# EAGLE design Luminis (EAGLE 9.0.0)
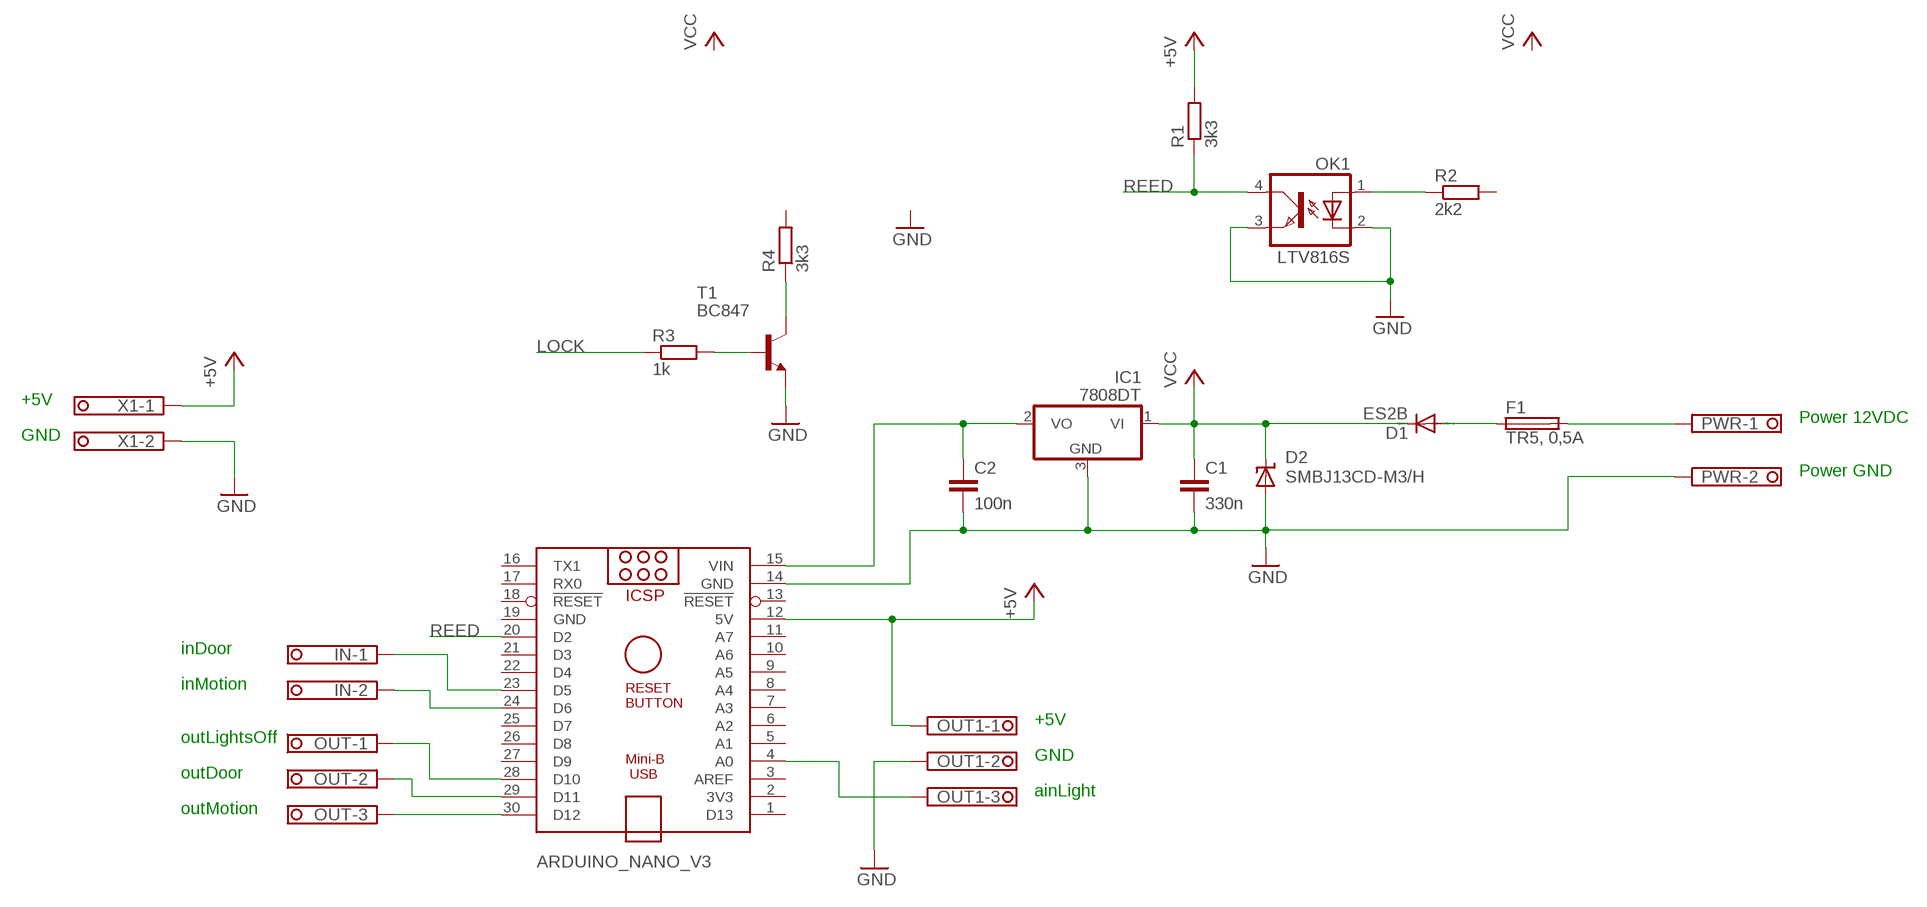
[diagram p0: schematic, sheet 1]

## Parts
ARDUINO_NANO_V3  ARDUINO_NANO  [ARDUINO_NANO]
C1  330n  C-EUC1206  [C1206]
C2  100n  C-EUC1206  [C1206]
D1  ES2B  DIODE-SMB  [SMB]
D2  SMBJ13CD-M3/H  SUPPRESSOR-SMBJ  [SMBJ]
F1  TR5, 0,5A  TR5  [TR5]
IC1  7808DT  [TO252]
IN  1751248  [1751248]
OK1  LTV816S  [DIL4-SMD]
OUT  1751251  [1751251]
OUT1  1751251  [1751251]
PWR  1751248  [1751248]
R1  3k3  R-EU_R1206  [R1206]
R2  2k2  R-EU_R1206  [R1206]
R3  1k  R-EU_R1206  [R1206]
R4  3k3  R-EU_R1206  [R1206]
T1  BC847  [SOT23]
X1  1751248  [1751248]

## Nets
+5V: ARDUINO_NANO_V3.12(5V) OUT1.1 R1.2 X1.1
GND: ARDUINO_NANO_V3.14(GND) C1.2 C2.2 D2.A IC1.3(GND) OK1.2(C) OK1.3(EMIT) OUT1.2 PWR.2 T1.2(E) X1.2
LOCK: R3.1
N$1: ARDUINO_NANO_V3.4(A0) OUT1.3
N$2: OK1.1(A) R2.1
N$3: ARDUINO_NANO_V3.30(D12) OUT.3
N$4: R4.1 T1.3(C)
N$5: F1.2 PWR.1
N$6: ARDUINO_NANO_V3.29(D11) OUT.2
N$7: ARDUINO_NANO_V3.28(D10) OUT.1
N$9: ARDUINO_NANO_V3.24(D6) IN.2
N$10: ARDUINO_NANO_V3.23(D5) IN.1
N$14: R3.2 T1.1(B)
N$46: D1.A F1.1
N$48: ARDUINO_NANO_V3.15(VIN) C2.1 IC1.2(VO)
REED: ARDUINO_NANO_V3.20(D2) OK1.4(COL) R1.1
VCC: C1.1 D1.C D2.C IC1.1(VI)
Unconnected: ARDUINO_NANO_V3.1(D13) ARDUINO_NANO_V3.2(3V3) ARDUINO_NANO_V3.3(AREF) ARDUINO_NANO_V3.5(A1) ARDUINO_NANO_V3.6(A2) ARDUINO_NANO_V3.7(A3) ARDUINO_NANO_V3.8(A4) ARDUINO_NANO_V3.9(A5) ARDUINO_NANO_V3.10(A6) ARDUINO_NANO_V3.11(A7) ARDUINO_NANO_V3.13(!RESET) ARDUINO_NANO_V3.16(TX1) ARDUINO_NANO_V3.17(RX0) ARDUINO_NANO_V3.18(!RESET) ARDUINO_NANO_V3.21(D3) ARDUINO_NANO_V3.22(D4) ARDUINO_NANO_V3.25(D7) ARDUINO_NANO_V3.26(D8) ARDUINO_NANO_V3.27(D9) R2.2 R4.2

## Notes on the sheet
- +5V
- Power 12VDC
- GND
- Power GND
- inDoor
- inMotion
- +5V
- outLightsOff
- GND
- outDoor
- ainLight
- outMotion

## Power pins joined to a net without a drawn wire
GND: ARDUINO_NANO_V3.19(GND)

## Library data of the parts
ARDUINO_NANO_V3 = ArduinoNanoV30:ARDUINO_NANO: Arduino Nano V3.0 Overview: The Arduino Nano is a small, complete, and breadboard-friendly board based on the ATmega328 (Arduino Nano 3.x) or ATmega168 (Arduino Nano 2.x). It has more or less the same functionality of the Arduino Duemilanove, but in a different package. It lacks only a DC power jack, and works with a Mini-B USB cable instead of a standard one. The Nano was designed and is being produced by Gravitech. Specifications: Microcontroller Atmel ATmega168 or ATmega328 Operating Voltage (logic level) 5 V Input Voltage (recommended) 7-12 V Input Voltage (limits) 6-20 V Digital I/O Pins 14 (of which 6 provide PWM output) Analog Input Pins 8 DC Current per I/O Pin 40 mA Flash Memory 16 KB (ATmega168) or 32 KB (ATmega328) of which 2 KB used by bootloader SRAM 1 KB (ATmega168) or 2 KB (ATmega328) EEPROM 512 bytes (ATmega168) or 1 KB (ATmega328) Clock Speed 16 MHz Dimensions 0.73" x 1.70" Length 45 mm Width 18 mm Weigth 5 g Power: The Arduino Nano can be powered via the Mini-B USB connection, 6-20V unregulated external power supply (pin 30), or 5V regulated external power supply (pin 27). The power source is automatically selected to the highest voltage source. Memory: The ATmega168 has 16 KB of flash memory for storing code (of which 2 KB is used for the bootloader); the ATmega328 has 32 KB, (also with 2 KB used for the bootloader). The ATmega168 has 1 KB of SRAM and 512 bytes of EEPROM (which can be read and written with the EEPROM library); the ATmega328 has 2 KB of SRAM and 1 KB of EEPROM. Input and Output: Each of the 14 digital pins on the Nano can be used as an input or output, using pinMode(), digitalWrite(), and digitalRead() functions. They operate at 5 volts. Each pin can provide or receive a maximum of 40 mA and has an internal pull-up resistor (disconnected by default) of 20-50 kOhms. In addition, some pins have specialized functions. Visit Arduino - ArduinoBoardNano <https://www.arduino.cc/en/Main/ArduinoBoardNano>
C1 C2 = rcl:C-EU: CAPACITOR, European symbol; SPICEPREFIX: C
D1 = diode:DIODE-: DIODE
D2 = diode:SUPPRESSOR-: Suppressor diode
F1 = fuse:TR5: FUSE Wickmann; OC_FARNELL: unknown; OC_NEWARK: unknown
IC1 = linear:78*: Positive VOLTAGE REGULATOR Source: http://cache.national.com/ds/LM/LM78L05.pdf http://www.fairchildsemi.com/ds/LM/LM7805.pdf
IN PWR X1 = con-phoenix-350:1751248: MKDS 1/ 2-3,5 Printklemme Nennstrom: 10 A Bemessungsspannung: 160 V Raster: 3,5 mm Polzahl: 2 Montageart: Löten Anschlussart: Schraubanschluss Anschlussrichtung vom Leiter zur Platine: 0° Source: http://eshop.phoenixcontact.com .. 1751248.pdf; OC_FARNELL: unknown; OC_NEWARK: unknown
OK1 = optocoupler:LTV816: OPTO COUPLER Source: LITEON, LTV816.pdf
OUT OUT1 = con-phoenix-350:1751251: MKDS 1/ 3-3,5 Printklemme Nennstrom: 10 A Bemessungsspannung: 160 V Raster: 3,5 mm Polzahl: 3 Montageart: Löten Anschlussart: Schraubanschluss Anschlussrichtung vom Leiter zur Platine: 0° Source: http://eshop.phoenixcontact.com .. 1751251.pdf; OC_FARNELL: unknown; OC_NEWARK: unknown
R1-R4 = rcl:R-EU_: RESISTOR, European symbol; SPICEPREFIX: R
T1 = transistor:BC847: NPN TRANSISTOR

## Board
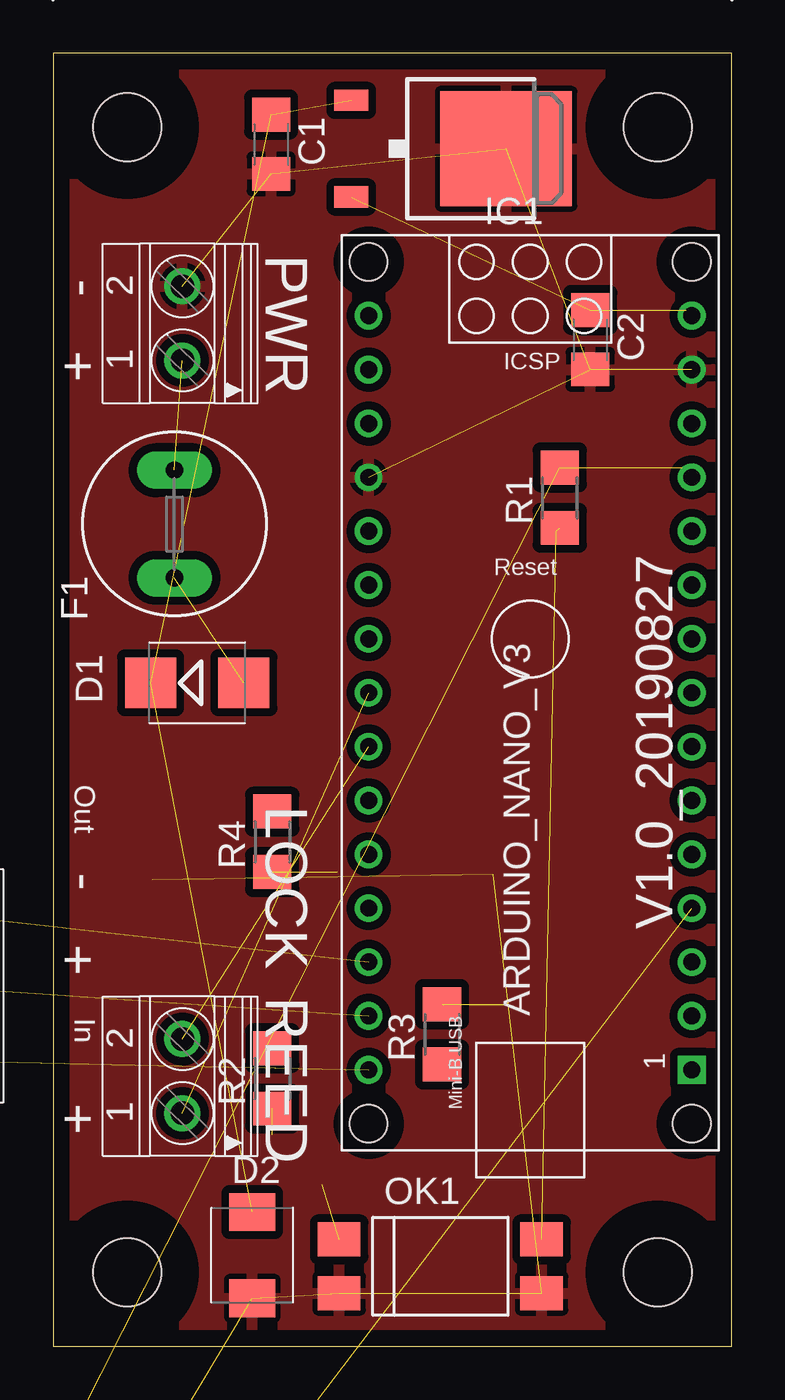
[diagram p1: board, top side]
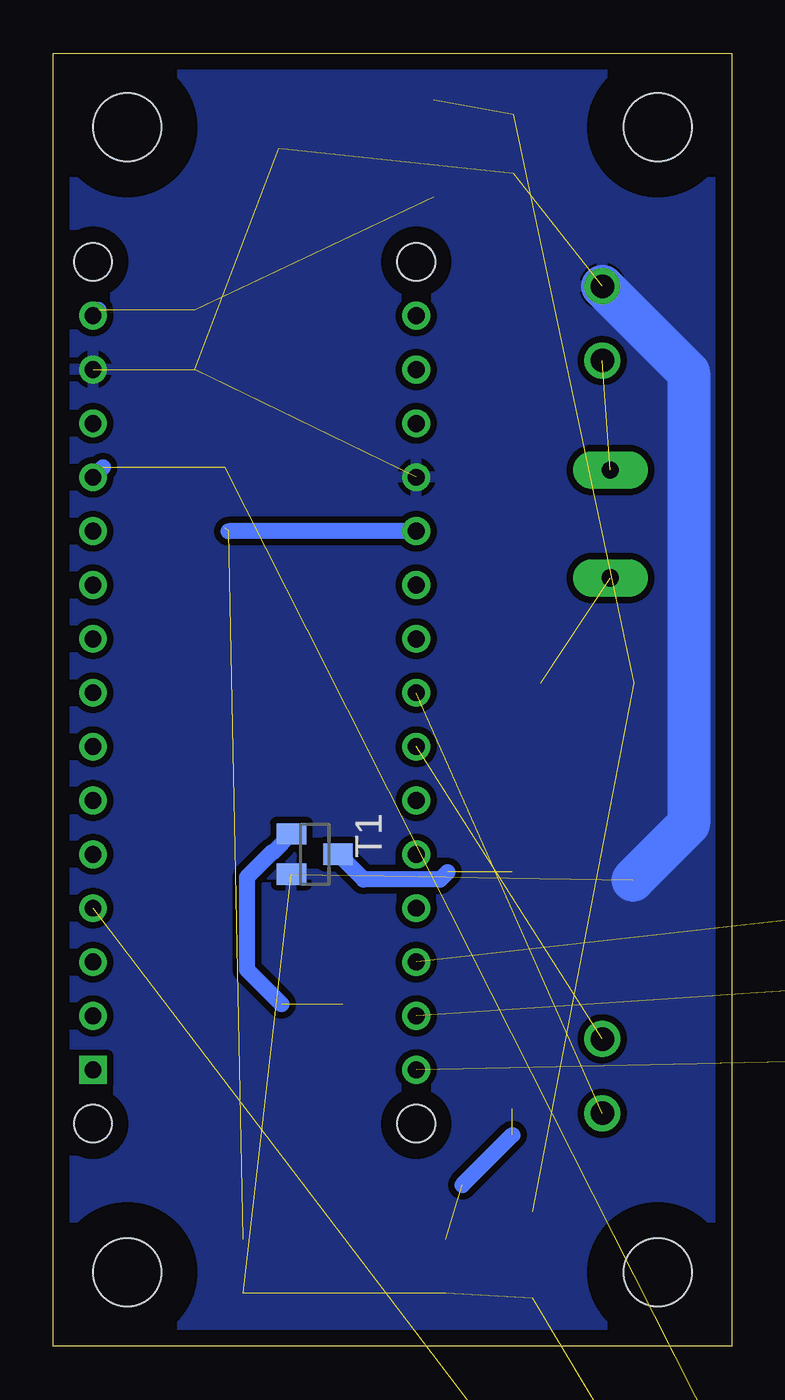
[diagram p2: board, bottom side, seen from below]

Size 32 x 61 mm. Coordinates in mm from the lower left corner, seen from the top.
Outline: 0,0 32,0 32,61 0,61 0,0
Copper layers (1*16): Top 0.035mm / dielectric 1.5mm / Bottom 0.035mm
Design rules "default *": minimum track width 20mil, minimum drill 0.35mm, track to track 6mil, track to pad 6mil, pad to pad 6mil, via to via 6mil, smd to smd 6mil, copper to edge 30mil, drill to drill 6mil, minimum pad ring 10mil, minimum via ring 8mil, stop-mask expansion 4mil, vias tented up to drill 0mil, thermal gap 10mil
Holes 3.2 mm at 3.5,57.5 28.5,57.5 3.5,3.5 28.5,3.5
tRestrict: area 0.5,54.5 to 6.5,60.5; area 25.5,54.5 to 31.5,60.5; area 0.5,0.5 to 6.5,6.5; area 25.5,0.5 to 31.5,6.5
bRestrict: area 0.5,54.5 to 6.5,60.5; area 25.5,54.5 to 31.5,60.5; area 0.5,0.5 to 6.5,6.5; area 25.5,0.5 to 31.5,6.5

### Footprints (pad centres in the part's own frame; a part is rotated, then mirrored left to right if it is on the bottom)
ARDUINO_NANO = drill 0.8 square: 1 -20.32,-7.62 | drill 0.8: 2 -17.78,-7.62; 3 -15.24,-7.62; 4 -12.7,-7.62; 5 -10.16,-7.62; 6 -7.62,-7.62; 7 -5.08,-7.62; 8 -2.54,-7.62; 9 0,-7.62; 10 2.54,-7.62; 11 5.08,-7.62; 12 7.62,-7.62; 13 10.16,-7.62; 14 12.7,-7.62; 15 15.24,-7.62; 16 15.24,7.62; 17 12.7,7.62; 18 10.16,7.62; 19 7.62,7.62; 20 5.08,7.62; 21 2.54,7.62; 22 0,7.62; 23 -2.54,7.62; 24 -5.08,7.62; 25 -7.62,7.62; 26 -10.16,7.62; 27 -12.7,7.62; 28 -15.24,7.62; 29 -17.78,7.62; 30 -20.32,7.62 | hole 1.778: -22.86,-7.62; -22.86,7.62; 17.78,7.62; 17.78,-7.62
C1206 = smd 1.6 x 1.8: 1 -1.4,0; 2 1.4,0
SMB = smd 2.4 x 2.4: A 2.2,0; C -2.2,0
SMBJ = smd 1.78 x 2.16: A 2.04,0; C -2.03,0
TR5 = drill 0.813 pad 1.778 long: 1 -2.54,0; 2 2.54,0
TO252 = smd 1 x 1.6: 1 -2.28,-4.8; 2 2.28,-4.8 | smd 5.4 x 6.2: 3 0,2.5
1751248 = drill 1.1 pad 1.7: 1 -1.75,-0.1; 2 1.75,-0.1
DIL4-SMD = smd 1.6 x 2: 1 -1.27,-4.77; 2 1.27,-4.77; 3 1.27,4.77; 4 -1.27,4.77
1751251 = drill 1.1 pad 1.7: 1 -3.5,-0.1; 2 0,-0.1; 3 3.5,-0.1
R1206 = smd 1.6 x 1.803: 1 -1.422,0; 2 1.422,0
SOT23 = smd 1 x 1.4: 1 -0.95,-1.1; 2 0.95,-1.1; 3 0,1.1

### Placement (x,y rotation side)
ARDUINO_NANO_V3  22.5,33.37 90 top
C1  10.28,56.7 270 top
C2  25.32,47.48 270 top
D1  6.8,31.3 0 top
D2  9.39,4.31 270 top
F1  5.72,38.79 90 top
IC1  18.86,56.49 270 top
IN  6,12.75 90 top
OK1  18.26,3.78 270 top
OUT  -6,17 270 top  (outside the outline)
OUT1  -2.5,-17.5 0 top  (outside the outline)
PWR  6,48.25 90 top
R1  23.89,40.03 90 top
R2  10.34,12.64 90 top
R3  18.34,14.72 90 top
R4  10.34,23.8 90 top
T1  19.66,23.22 270 bottom
X1  -4,-34.5 0 top  (outside the outline)

### Tracks (layer width: path | path; a pad name or v marks a point on that pad's centre or on a via)
+5V  (3 unrouted)
  Bottom 0.762: 29.65,41.45 ARDUINO_NANO_V3.12
GND  (11 unrouted)
  Bottom 2.032: PWR.2 2.03,45.93 2.03,24.64 4.67,22
  pour Bottom (isolate 0.305): 0,61 32,61 32,0 0,0
  pour Top (isolate 0.381): 0,60.96 32,60.96 32,0 0,0
N$1  (1 unrouted)
N$2  (2 unrouted)
  Bottom 0.762: 12.7,7.62 10.34,9.98
N$3  (1 unrouted)
N$4  (1 unrouted)
  Bottom 0.762: 13.39,22.38 13.75,22.02 17.36,22.02 T1.3
N$5  (1 unrouted)
N$6  (1 unrouted)
N$7  (1 unrouted)
N$9  (1 unrouted)
N$10  (1 unrouted)
N$14  (1 unrouted)
  Bottom 0.762: T1.1 21.63,23.3 21.68,23.3 22.86,22.12 22.86,17.78 21.22,16.14
N$46  (1 unrouted)
N$48  (2 unrouted)
  Bottom 0.762: 29.84,48.88 ARDUINO_NANO_V3.15
REED  (2 unrouted)
  Bottom 0.762: ARDUINO_NANO_V3.20 23.73,38.45
VCC  (3 unrouted)

### Text on the board
tPlace: PWR | - | + | Out | LOCK | - | V1.0_20190827 | + | In | REED | +